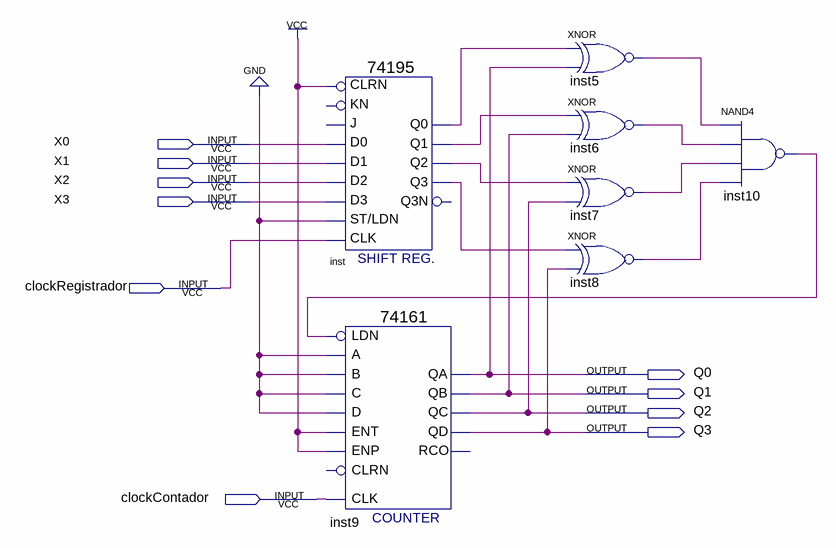
[diagram p0: schematic sheet]
// Quartus schematic Lab12.bdf as structural Verilog: 7 symbols, 10 pins
module Lab12 (
  input  X0,
  input  X1,
  input  X2,
  input  X3,
  input  clockRegistrador,
  input  clockContador,
  output Q0,
  output Q1,
  output Q2,
  output Q3
);

  wire inst5_out, inst6_out, inst7_out, inst8_out, inst10_out, inst_q0, inst_q1, inst_q2, inst_q3;

  \74195  inst (
    .\ST/LDN (1'b0), .CLRN(1'b1), .D2(X2), .D1(X1), .D0(X0), .CLK(clockRegistrador), .D3(X3), .Q3(inst_q3),
    .Q0(inst_q0), .Q1(inst_q1), .Q2(inst_q2));  // open: KN, J, Q3N
  \74161  inst9 (
    .CLK(clockContador), .ENP(1'b1), .LDN(inst10_out), .A(1'b0), .D(1'b0), .ENT(1'b1), .B(1'b0), .C(1'b0),
    .QD(Q3), .QC(Q2), .QB(Q1), .QA(Q0));  // open: CLRN, RCO
  xnor inst5 (inst5_out, inst_q0, Q0);
  xnor inst6 (inst6_out, inst_q1, Q1);
  xnor inst7 (inst7_out, inst_q2, Q2);
  xnor inst8 (inst8_out, inst_q3, Q3);
  nand inst10 (inst10_out, inst5_out, inst6_out, inst7_out, inst8_out);
endmodule
